# Altium project rtc.PrjPcb
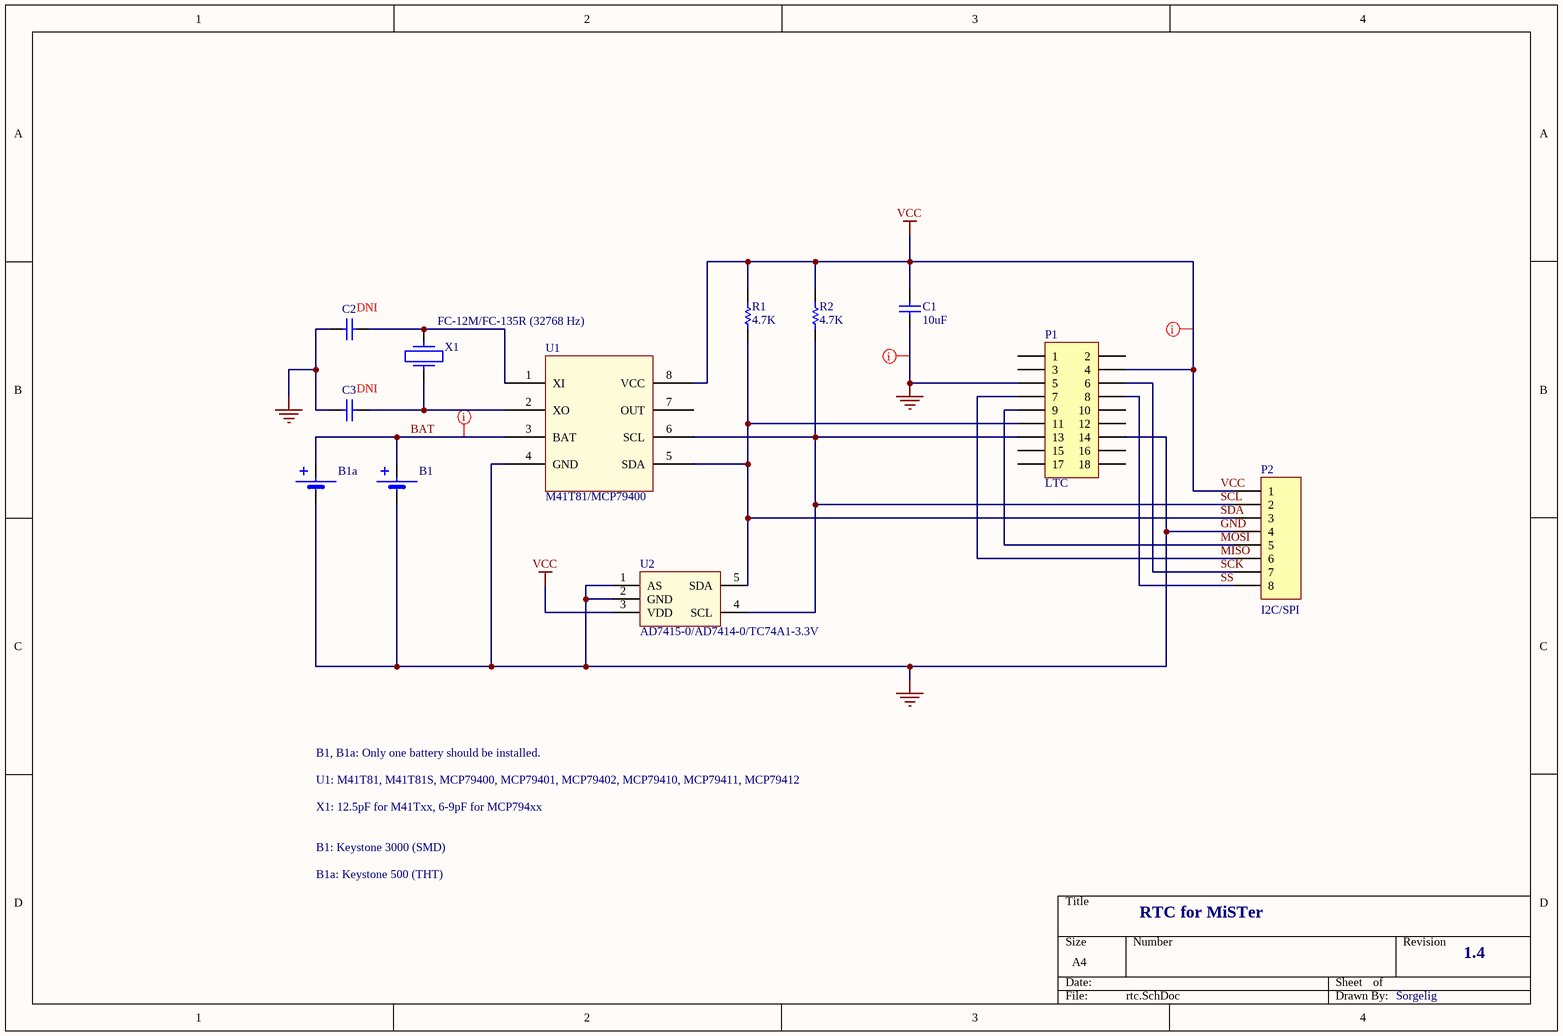
[diagram p0: rtc.SchDoc]
1 sheet, 12 parts. Net scope: global (net labels, ports and power ports of the same name join across sheets).
Board file: rtc.PcbDoc

## Sheet rtc.SchDoc
size A4

### Parts
B1  *  [KS3000]  (value not drawn)
B1a  BAT  [BAT]  (value not drawn)
C1  value 10uF  [C0805]  (hidden comment: C0805)
C2  C0805  [0805]  (value not drawn)
C3  C0805  [0805]  (value not drawn)
P1  LTC  [hdr9x2]
P2  I2C/SPI  [HDR1X8]
R1  4.7K  [R0805]
R2  4.7K  [R0805]
U1  M41T81/MCP79400  [SOIC8P]
U2  AD7415-0/AD7414-0/TC74A1-3.3V  [SOT23-5]
X1  FC-12M/FC-135R (32768 Hz)  [OSC]

### Nets
GND: B1.1 B1a.1 C1.1 C2.1 C3.1 P1.5 P1.14 P2.4 U1.4(GND) U2.1(AS) U2.2(GND)
VCC: C1.2 P1.4 P2.1 R1.2 R2.2 U1.8(VCC) U2.3(VDD)
BAT: B1.2 B1a.2 U1.3(BAT)
MISO: P1.7 P2.6
MOSI: P1.9 P2.5
SCK: P1.6 P2.7
SCL: P1.13 P2.2 R2.1 U1.6(SCL) U2.4(SCL)
SDA: P1.11 P2.3 R1.1 U1.5(SDA) U2.5(SDA)
SS: P1.8 P2.8
NetC2_2: C2.2 U1.1(XI) X1.1
NetC3_2: C3.2 U1.2(XO) X1.2

Not connected (* = marked no-connect by the designer): P1 1 2 3 10 12 15 16 17 18; U1 7(OUT)

### Layout directives
net class power: BAT, GND, VCC

### Notes on the sheet
- (near C2) DNI
- (near C3) DNI
- U1: M41T81, M41T81S, MCP79400, MCP79401, MCP79402, MCP79410, MCP79411, MCP79412
- B1, B1a: Only one battery should be installed.
- X1: 12.5pF for M41Txx, 6-9pF for MCP794xx
- B1: Keystone 3000 (SMD)
- B1a: Keystone 500 (THT)
- RTC for MiSTer
- 1.4
- Sorgelig

### Library data of the parts
B1 = BAT_KS3000
C1 = C0805: Ceramic Chip Capacitor - Standard; Note: Footprint corresponds to dimensions for bulk cassette packaging. This case size has tightened tolerances.; Published: 17-Jul-2002; LatestRevisionDate: 19-Mar-2004; LatestRevisionNote: Silkscreen size reduced.; DatasheetDocument: Mar-2001; PackageDocument: Mar-2001; PackageReference: 0805; Publisher: Altium Limited; Code_JEITA: 0805; Code_IPC: 2012[0805]; ComponentLink1Description: Manufacturer Link; ComponentLink1URL: http://www.kemet.com/; ComponentLink2Description: Datasheet; ComponentLink2URL: http://www.kemet.com/kemet/web/homepage/kechome.nsf/vapubfilesname/F3102TA.pdf/$file/F3102TA.pdf
C2 C3 = C0805: Ceramic Chip Capacitor - Standard; Note: Footprint corresponds to dimensions for bulk cassette packaging. This case size has tightened tolerances.; Value: 9pF; Published: 17-Jul-2002; LatestRevisionDate: 19-Mar-2004; LatestRevisionNote: Silkscreen size reduced.; DatasheetDocument: Mar-2001; PackageDocument: Mar-2001; PackageReference: 0805; Publisher: Altium Limited; Code_JEITA: 0805; Code_IPC: 2012[0805]; ComponentLink1Description: Manufacturer Link; ComponentLink1URL: http://www.kemet.com/; ComponentLink2Description: Datasheet; ComponentLink2URL: http://www.kemet.com/kemet/web/homepage/kechome.nsf/vapubfilesname/F3102TA.pdf/$file/F3102TA.pdf
P1 = HDR9x2
P2 = Header 8: Header, 8-Pin; LatestRevisionDate: 17-Jul-2002; LatestRevisionNote: Re-released for DXP Platform.; Publisher: Altium Limited
R1 R2 = ERJ6RS: Low Ohmic Value Thick Film Chip Resistor, 0.1 Ohm to 0.2 Ohm Range, 1%, 2% and 5% Tolerance, 0805 Size, 0.125 W; Published: 17-Dec-2003; LatestRevisionDate: 19-Mar-2004; LatestRevisionNote: Silkscreen size reduced.; PackageDocument: Mar-2003; PackageReference: 6-0805; Publisher: Altium Limited; Code_IPC: 2012 [0805]; ComponentLink1Description: Manufacturer Link; ComponentLink1URL: http://www.panasonic.com/industrial/components/resistive_products.htm; ComponentLink2Description: Datasheet; ComponentLink2URL: http://www.panasonic.com/industrial/components/pdf/AOA0000CE3.pdf
U1 = M41T
U2 = AD7415
X1 = OSC